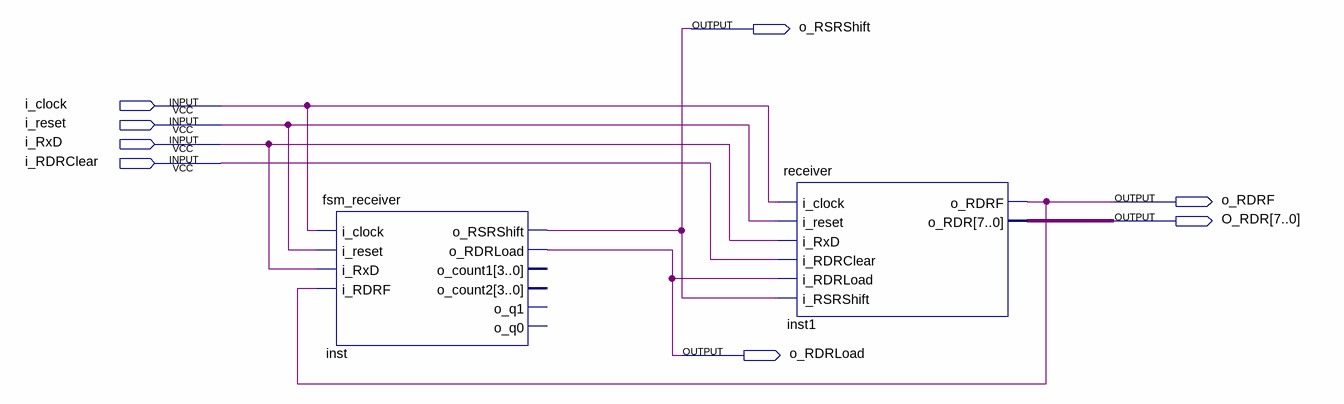
[diagram p0: schematic sheet]
// Quartus schematic top_receiver.bdf as structural Verilog: 2 symbols, 8 pins
module top_receiver (
  input  i_clock,
  input  i_reset,
  input  i_RxD,
  input  i_RDRClear,
  output o_RSRShift,
  output o_RDRF,
  output [7:0] O_RDR,
  output o_RDRLoad
);

  fsm_receiver inst (
    .i_clock(i_clock), .i_reset(i_reset), .i_RxD(i_RxD), .i_RDRF(o_RDRF), .o_RSRShift(o_RSRShift),
    .o_RDRLoad(o_RDRLoad));  // open: o_count1, o_count2, o_q1, o_q0
  receiver inst1 (
    .i_clock(i_clock), .i_reset(i_reset), .i_RxD(i_RxD), .i_RDRClear(i_RDRClear), .i_RDRLoad(o_RDRLoad),
    .i_RSRShift(o_RSRShift), .o_RDRF(o_RDRF), .o_RDR(O_RDR));
endmodule
